# Altium schematic sheet SH15 - SDRAM EMIF B.SchDoc
size 386 x 246 mm
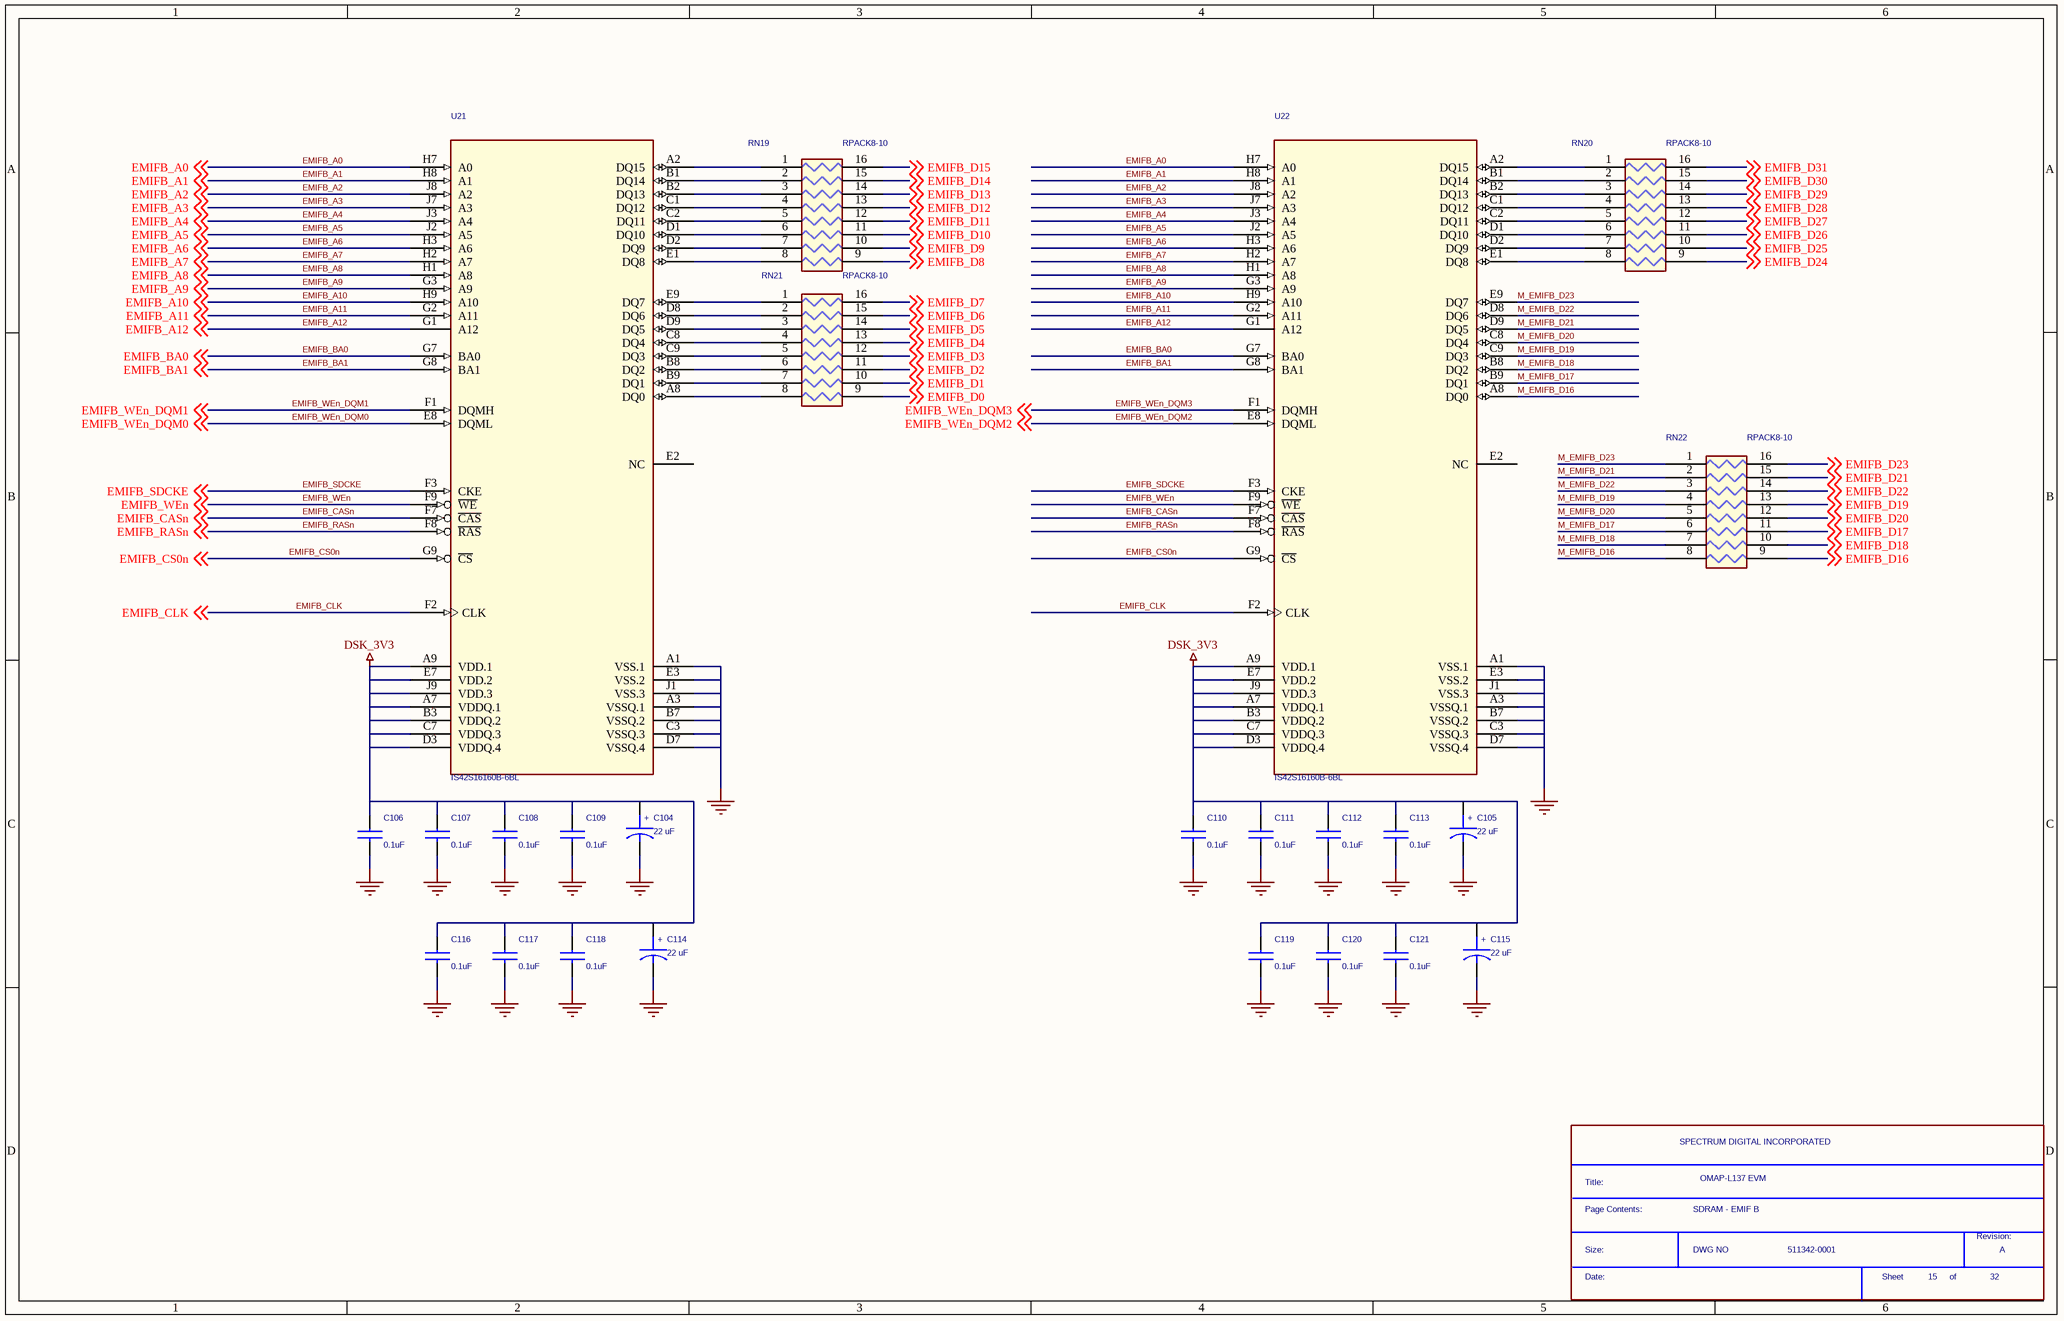
[diagram p0: SH15 - SDRAM EMIF B.SchDoc]

## Parts
*  Page Contents:: SDRAM - EMIF B  RevCode: A  Title: OMAP-L137 EVM  OrgName: SPECTRUM DIGITAL INCORPORATED  Doc: 511342-0001  Page Number: 15  Page Count: 32  (hidden comment: SDTitleBlock)  (graphical)
C104  22 uF  [C1206-40X70]
C105  22 uF  [C1206-40X70]
C106  0.1uF  [c402-25]
C107  0.1uF  [c402-25]
C108  0.1uF  [c402-25]
C109  0.1uF  [c402-25]
C110  0.1uF  [c402-25]
C111  0.1uF  [c402-25]
C112  0.1uF  [c402-25]
C113  0.1uF  [c402-25]
C114  22 uF  [C1206-40X70]
C115  22 uF  [C1206-40X70]
C116  0.1uF  [c402-25]
C117  0.1uF  [c402-25]
C118  0.1uF  [c402-25]
C119  0.1uF  [c402-25]
C120  0.1uF  [c402-25]
C121  0.1uF  [c402-25]
RN19  RPACK8-10  [rpak16-10x25-2hv]
RN20  RPACK8-10  [rpak16-10x25-2hv]
RN21  RPACK8-10  [rpak16-10x25-2hv]
RN22  RPACK8-10  [rpak16-10x25-2hv]
U21  IS42S16160B-6BL  [bga54-3x9-issi]
U22  IS42S16160B-6BL  [bga54-3x9-issi]

## Nets
DSK_3V3: C104.1(ANODE) C105.1(ANODE) C106.1 C107.1 C108.1 C109.1 C110.1 C111.1 C112.1 C113.1 C114.1(ANODE) C115.1(ANODE) C116.1 C117.1 C118.1 C119.1 C120.1 C121.1 U21.A7(VDDQ.1) U21.A9(VDD.1) U21.B3(VDDQ.2) U21.C7(VDDQ.3) U21.D3(VDDQ.4) U21.E7(VDD.2) U21.J9(VDD.3) U22.A7(VDDQ.1) U22.A9(VDD.1) U22.B3(VDDQ.2) U22.C7(VDDQ.3) U22.D3(VDDQ.4) U22.E7(VDD.2) U22.J9(VDD.3)
GND: C104.2(CATHODE) C105.2(CATHODE) C106.2 C107.2 C108.2 C109.2 C110.2 C111.2 C112.2 C113.2 C114.2(CATHODE) C115.2(CATHODE) C116.2 C117.2 C118.2 C119.2 C120.2 C121.2 U21.A1(VSS.1) U21.A3(VSSQ.1) U21.B7(VSSQ.2) U21.C3(VSSQ.3) U21.D7(VSSQ.4) U21.E3(VSS.2) U21.J1(VSS.3) U22.A1(VSS.1) U22.A3(VSSQ.1) U22.B7(VSSQ.2) U22.C3(VSSQ.3) U22.D7(VSSQ.4) U22.E3(VSS.2) U22.J1(VSS.3)
EMIFB_A0: U21.H7(A0) U22.H7(A0) ; off-sheet EMIFB_A0
EMIFB_A1: U21.H8(A1) U22.H8(A1) ; off-sheet EMIFB_A1
EMIFB_A2: U21.J8(A2) U22.J8(A2) ; off-sheet EMIFB_A2
EMIFB_A3: U21.J7(A3) U22.J7(A3) ; off-sheet EMIFB_A3
EMIFB_A4: U21.J3(A4) U22.J3(A4) ; off-sheet EMIFB_A4
EMIFB_A5: U21.J2(A5) U22.J2(A5) ; off-sheet EMIFB_A5
EMIFB_A6: U21.H3(A6) U22.H3(A6) ; off-sheet EMIFB_A6
EMIFB_A7: U21.H2(A7) U22.H2(A7) ; off-sheet EMIFB_A7
EMIFB_A8: U21.H1(A8) U22.H1(A8) ; off-sheet EMIFB_A8
EMIFB_A9: U21.G3(A9) U22.G3(A9) ; off-sheet EMIFB_A9
EMIFB_A10: U21.H9(A10) U22.H9(A10) ; off-sheet EMIFB_A10
EMIFB_A11: U21.G2(A11) U22.G2(A11) ; off-sheet EMIFB_A11
EMIFB_A12: U21.G1(A12) U22.G1(A12) ; off-sheet EMIFB_A12
EMIFB_BA0: U21.G7(BA0) U22.G7(BA0) ; off-sheet EMIFB_BA0
EMIFB_BA1: U21.G8(BA1) U22.G8(BA1) ; off-sheet EMIFB_BA1
EMIFB_CASn: U21.F7(~{CAS}) U22.F7(~{CAS}) ; off-sheet EMIFB_CASn
EMIFB_CLK: U21.F2(CLK) U22.F2(CLK) ; off-sheet EMIFB_CLK
EMIFB_CS0n: U21.G9(~{CS}) U22.G9(~{CS}) ; off-sheet EMIFB_CS0n
EMIFB_D0: RN21.9 ; off-sheet EMIFB_D0
EMIFB_D1: RN21.10 ; off-sheet EMIFB_D1
EMIFB_D2: RN21.11 ; off-sheet EMIFB_D2
EMIFB_D3: RN21.12 ; off-sheet EMIFB_D3
EMIFB_D4: RN21.13 ; off-sheet EMIFB_D4
EMIFB_D5: RN21.14 ; off-sheet EMIFB_D5
EMIFB_D6: RN21.15 ; off-sheet EMIFB_D6
EMIFB_D7: RN21.16 ; off-sheet EMIFB_D7
EMIFB_D8: RN19.9 ; off-sheet EMIFB_D8
EMIFB_D9: RN19.10 ; off-sheet EMIFB_D9
EMIFB_D10: RN19.11 ; off-sheet EMIFB_D10
EMIFB_D11: RN19.12 ; off-sheet EMIFB_D11
EMIFB_D12: RN19.13 ; off-sheet EMIFB_D12
EMIFB_D13: RN19.14 ; off-sheet EMIFB_D13
EMIFB_D14: RN19.15 ; off-sheet EMIFB_D14
EMIFB_D15: RN19.16 ; off-sheet EMIFB_D15
EMIFB_D16: RN22.9 ; off-sheet EMIFB_D16
EMIFB_D17: RN22.11 ; off-sheet EMIFB_D17
EMIFB_D18: RN22.10 ; off-sheet EMIFB_D18
EMIFB_D19: RN22.13 ; off-sheet EMIFB_D19
EMIFB_D20: RN22.12 ; off-sheet EMIFB_D20
EMIFB_D21: RN22.15 ; off-sheet EMIFB_D21
EMIFB_D22: RN22.14 ; off-sheet EMIFB_D22
EMIFB_D23: RN22.16 ; off-sheet EMIFB_D23
EMIFB_D24: RN20.9 ; off-sheet EMIFB_D24
EMIFB_D25: RN20.10 ; off-sheet EMIFB_D25
EMIFB_D26: RN20.11 ; off-sheet EMIFB_D26
EMIFB_D27: RN20.12 ; off-sheet EMIFB_D27
EMIFB_D28: RN20.13 ; off-sheet EMIFB_D28
EMIFB_D29: RN20.14 ; off-sheet EMIFB_D29
EMIFB_D30: RN20.15 ; off-sheet EMIFB_D30
EMIFB_D31: RN20.16 ; off-sheet EMIFB_D31
EMIFB_RASn: U21.F8(~{RAS}) U22.F8(~{RAS}) ; off-sheet EMIFB_RASn
EMIFB_SDCKE: U21.F3(CKE) U22.F3(CKE) ; off-sheet EMIFB_SDCKE
EMIFB_WEn: U21.F9(~{WE}) U22.F9(~{WE}) ; off-sheet EMIFB_WEn
EMIFB_WEn_DQM0: U21.E8(DQML) ; off-sheet EMIFB_WEn_DQM0
EMIFB_WEn_DQM1: U21.F1(DQMH) ; off-sheet EMIFB_WEn_DQM1
EMIFB_WEn_DQM2: U22.E8(DQML) ; off-sheet EMIFB_WEn_DQM2
EMIFB_WEn_DQM3: U22.F1(DQMH) ; off-sheet EMIFB_WEn_DQM3
M_EMIFB_D16: RN22.8 U22.A8(DQ0)
M_EMIFB_D17: RN22.6 U22.B9(DQ1)
M_EMIFB_D18: RN22.7 U22.B8(DQ2)
M_EMIFB_D19: RN22.4 U22.C9(DQ3)
M_EMIFB_D20: RN22.5 U22.C8(DQ4)
M_EMIFB_D21: RN22.2 U22.D9(DQ5)
M_EMIFB_D22: RN22.3 U22.D8(DQ6)
M_EMIFB_D23: RN22.1 U22.E9(DQ7)
NetRN19_1: RN19.1 U21.A2(DQ15)
NetRN19_2: RN19.2 U21.B1(DQ14)
NetRN19_3: RN19.3 U21.B2(DQ13)
NetRN19_4: RN19.4 U21.C1(DQ12)
NetRN19_5: RN19.5 U21.C2(DQ11)
NetRN19_6: RN19.6 U21.D1(DQ10)
NetRN19_7: RN19.7 U21.D2(DQ9)
NetRN19_8: RN19.8 U21.E1(DQ8)
NetRN20_1: RN20.1 U22.A2(DQ15)
NetRN20_2: RN20.2 U22.B1(DQ14)
NetRN20_3: RN20.3 U22.B2(DQ13)
NetRN20_4: RN20.4 U22.C1(DQ12)
NetRN20_5: RN20.5 U22.C2(DQ11)
NetRN20_6: RN20.6 U22.D1(DQ10)
NetRN20_7: RN20.7 U22.D2(DQ9)
NetRN20_8: RN20.8 U22.E1(DQ8)
NetRN21_1: RN21.1 U21.E9(DQ7)
NetRN21_2: RN21.2 U21.D8(DQ6)
NetRN21_3: RN21.3 U21.D9(DQ5)
NetRN21_4: RN21.4 U21.C8(DQ4)
NetRN21_5: RN21.5 U21.C9(DQ3)
NetRN21_6: RN21.6 U21.B8(DQ2)
NetRN21_7: RN21.7 U21.B9(DQ1)
NetRN21_8: RN21.8 U21.A8(DQ0)

Not connected (* = marked no-connect by the designer): U21 E2(NC); U22 E2(NC)

## Notes on the sheet
- (in symbol CAP P) +
- (in symbol SDTitleBlock) Title:; Page Contents:; Revision:; Size:; DWG NO; Date:; Sheet; of

## Library data of the parts
C104 C105 C114 = CAP P: Part #: 101064-0221R; Spectrum Part#: 101347-0102
C106-C113 C116-C121 = CAP NP_0: Part #: 101587-1100R
C115 = CAP P: Spectrum Part#: 101347-0102; Part #: 101064-0221R
RN19-RN22 = RESISTOR DIP 8_0: Part #: 101069-1000R
U21 U22 = IS42S16160B-6BL_0: Part #: 102799-0006R